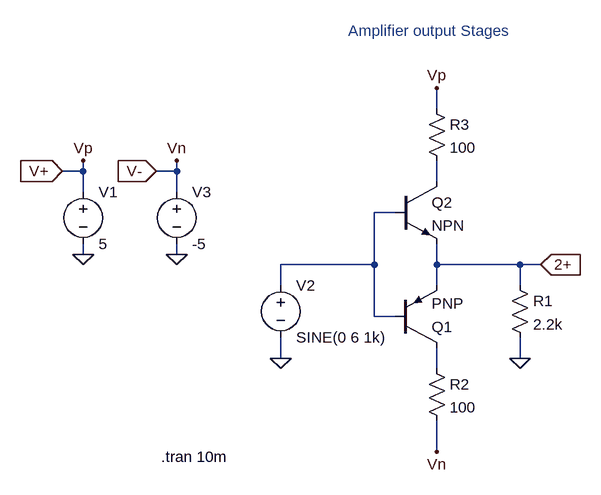
[diagram p0: schematic pull_out_stage.asc]
pull_out_stage.asc, the LTspice schematic file:
Version 4
SHEET 1 880 680
WIRE 192 -384 192 -416
WIRE -352 -288 -352 -304
WIRE -352 -288 -384 -288
WIRE -208 -288 -208 -304
WIRE -208 -288 -240 -288
WIRE 192 -272 192 -304
WIRE -352 -256 -352 -288
WIRE -208 -256 -208 -288
WIRE 128 -224 96 -224
WIRE -352 -160 -352 -176
WIRE -208 -160 -208 -176
WIRE 96 -144 96 -224
WIRE 96 -144 -48 -144
WIRE 192 -144 192 -176
WIRE 320 -144 192 -144
WIRE 352 -144 320 -144
WIRE -48 -112 -48 -144
WIRE 192 -112 192 -144
WIRE 320 -112 320 -144
WIRE 96 -64 96 -144
WIRE 128 -64 96 -64
WIRE -48 0 -48 -32
WIRE 320 0 320 -32
WIRE 192 16 192 -16
WIRE 192 144 192 96
FLAG 320 0 0
FLAG -352 -160 0
FLAG -352 -304 Vp
FLAG 192 -416 Vp
FLAG -48 0 0
FLAG -384 -288 V+
IOPIN -384 -288 In
FLAG 352 -144 2+
IOPIN 352 -144 In
FLAG -208 -160 0
FLAG -208 -304 Vn
FLAG -240 -288 V-
IOPIN -240 -288 In
FLAG 192 144 Vn
SYMBOL pnp 128 -16 M180
SYMATTR InstName Q1
SYMBOL npn 128 -272 R0
SYMATTR InstName Q2
SYMBOL res 304 -128 R0
SYMATTR InstName R1
SYMATTR Value 2.2k
SYMBOL res 176 0 R0
SYMATTR InstName R2
SYMATTR Value 100
SYMBOL res 176 -400 R0
SYMATTR InstName R3
SYMATTR Value 100
SYMBOL voltage -352 -272 R0
WINDOW 123 0 0 Left 0
WINDOW 39 0 0 Left 0
SYMATTR InstName V1
SYMATTR Value 5
SYMBOL voltage -48 -128 R0
WINDOW 123 0 0 Left 0
WINDOW 39 0 0 Left 0
SYMATTR InstName V2
SYMATTR Value SINE(0 6 1k)
SYMBOL voltage -208 -272 R0
WINDOW 123 0 0 Left 0
WINDOW 39 0 0 Left 0
SYMATTR InstName V3
SYMATTR Value -5
TEXT -232 152 Left 2 !.tran 10m
TEXT 56 -504 Left 2 ;Amplifier output Stages

The netlist it stands for:
* pull_out_stage.asc
Q1 N003 N002 2+ 0 PNP
Q2 N001 N002 2+ 0 NPN
R1 2+ 0 2.2k
R2 N003 V- 100
R3 V+ N001 100
V1 V+ 0 5
V2 N002 0 SINE(0 6 1k)
V3 V- 0 -5
.model NPN NPN
.model PNP PNP
.lib standard.bjt
.tran 10m
* Amplifier output Stages
.backanno
.end